# EAGLE design UART_Breakout_ES_PCB (EAGLE 9.6.2)
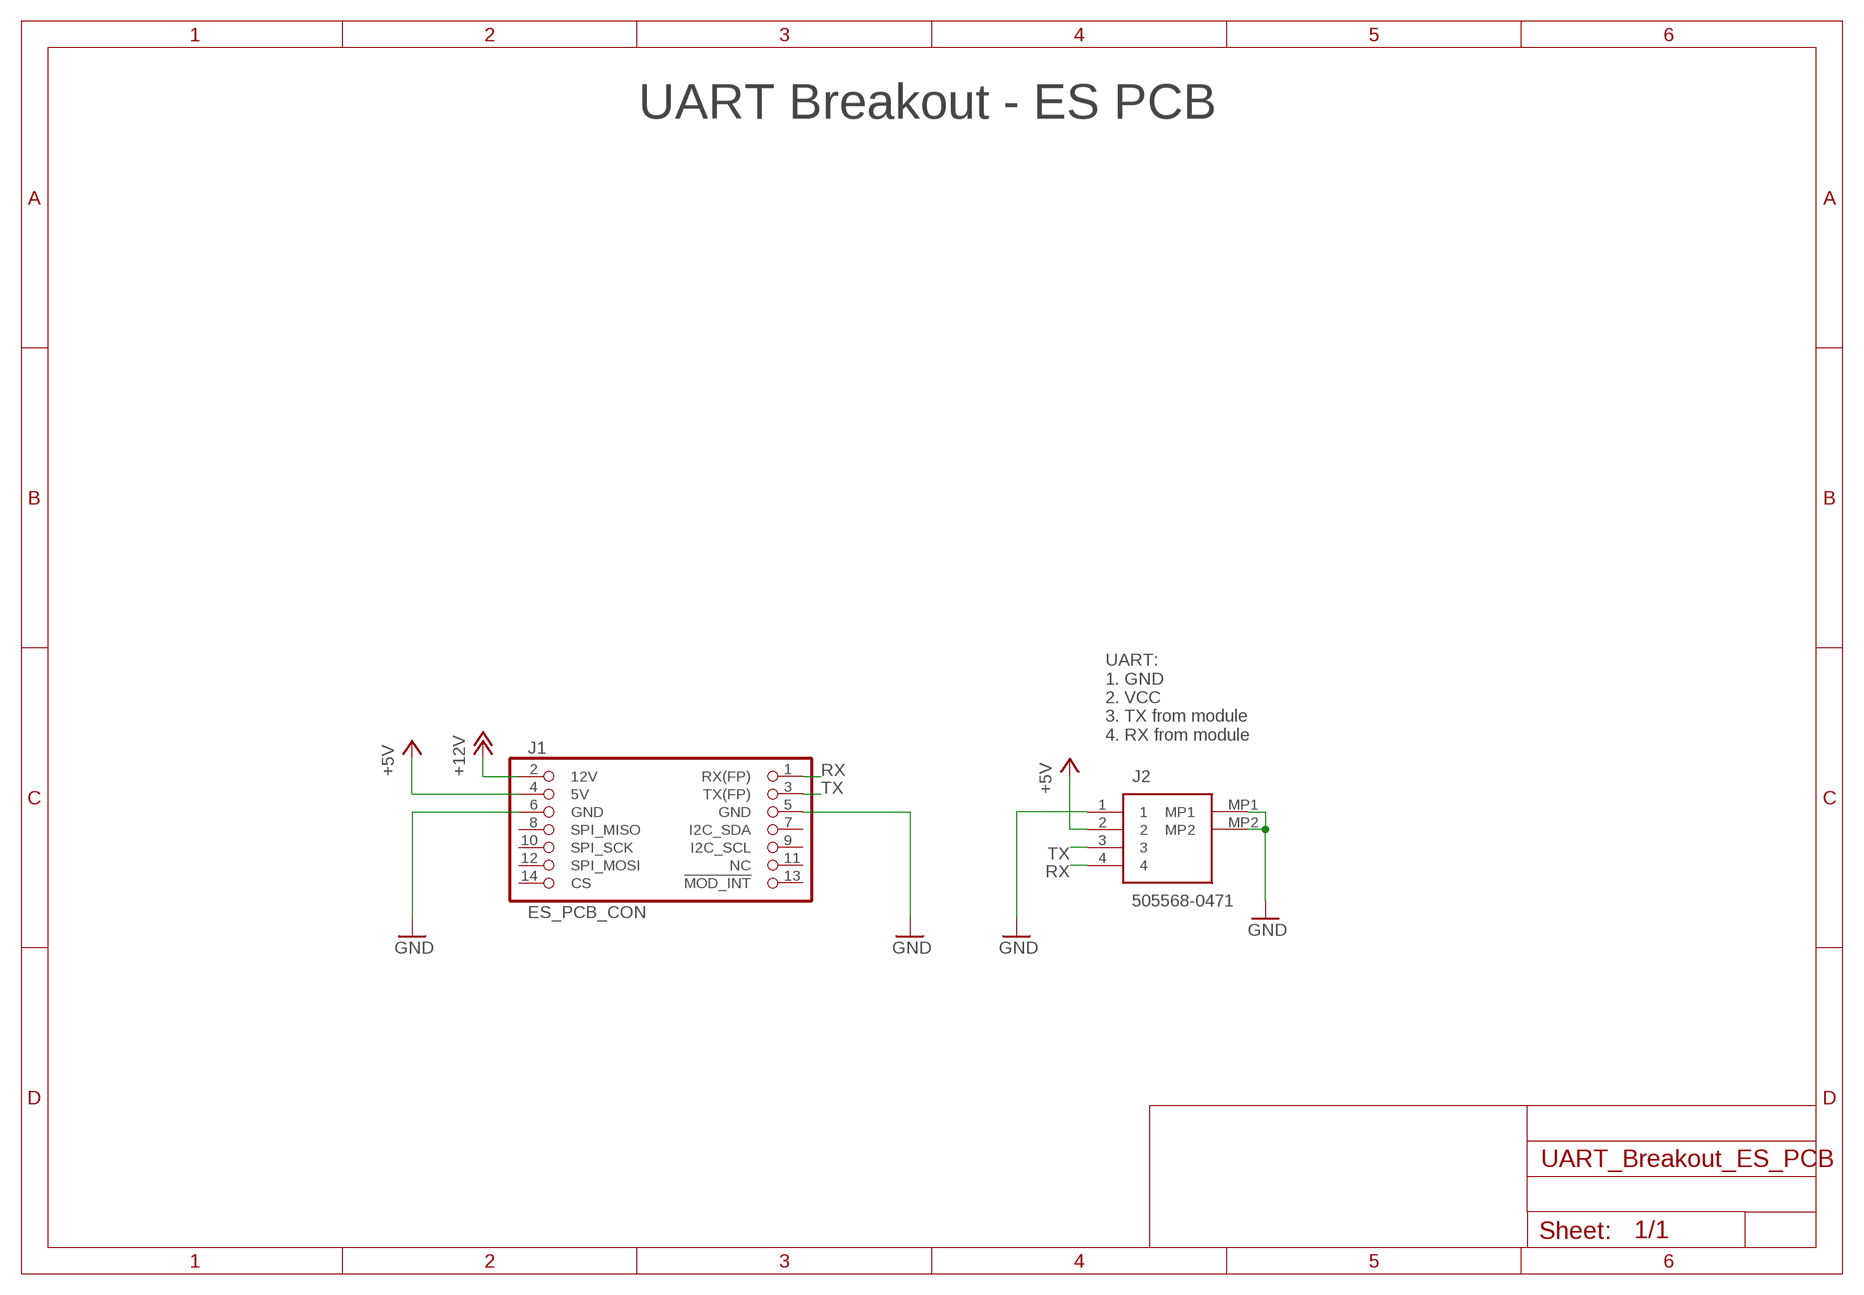
[diagram p0: schematic, sheet 1]

## Parts
J1  ES_PCB_CON  [ES_PCB_CON]
J2  505568-0471  [5055680471]

## Nets
+5V: J1.4(5V) J2.2
+12V: J1.2(12V)
GND: J1.6(GND) J2.1 J2.MP1 J2.MP2
N$1: J1.5(GND) ; supply symbol labelled GND
RX: J1.1(RX(FP)) J2.4
TX: J1.3(TX(FP)) J2.3
Unconnected: J1.7(I2C_SDA) J1.8(SPI_MISO) J1.9(I2C_SCL) J1.10(SPI_SCK) J1.11(NC) J1.12(SPI_MOSI) J1.13(!MOD_INT) J1.14(CS)

## Notes on the sheet
- UART Breakout - ES PCB
- UART:
  1. GND
  2. VCC
  3. TX from module
  4. RX from module

## Library data of the parts
J1 = Unicorn_ACU_LIB:ES_PCB_CON
J2 = Unicorn_ACU_LIB:505568-0471: Horizontal

## Net classes
0 default: width 0.3 mm

## Board
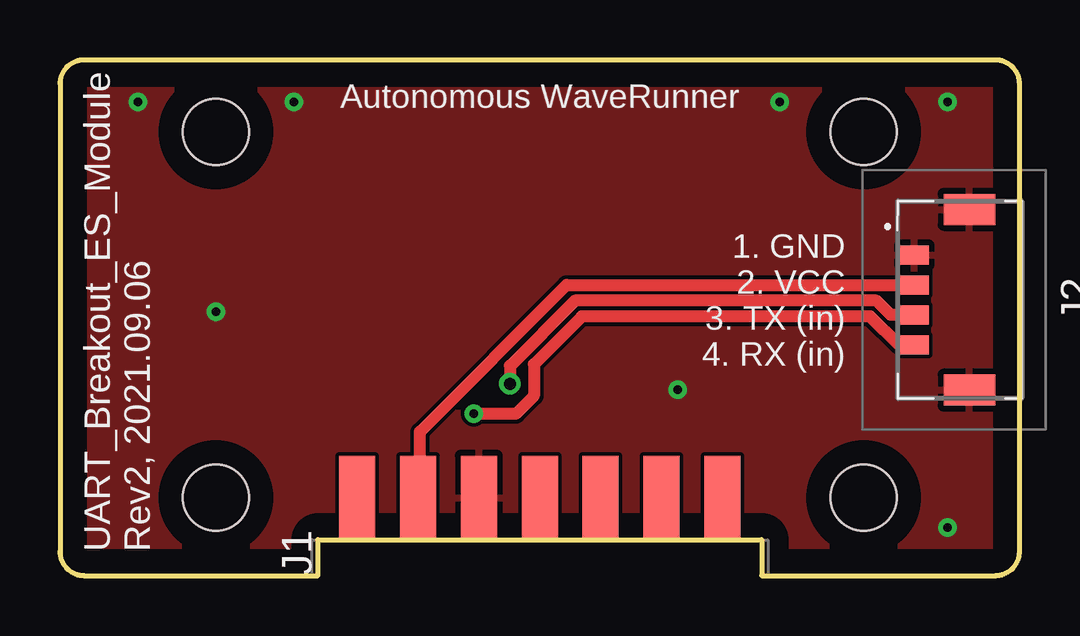
[diagram p1: board, top side]
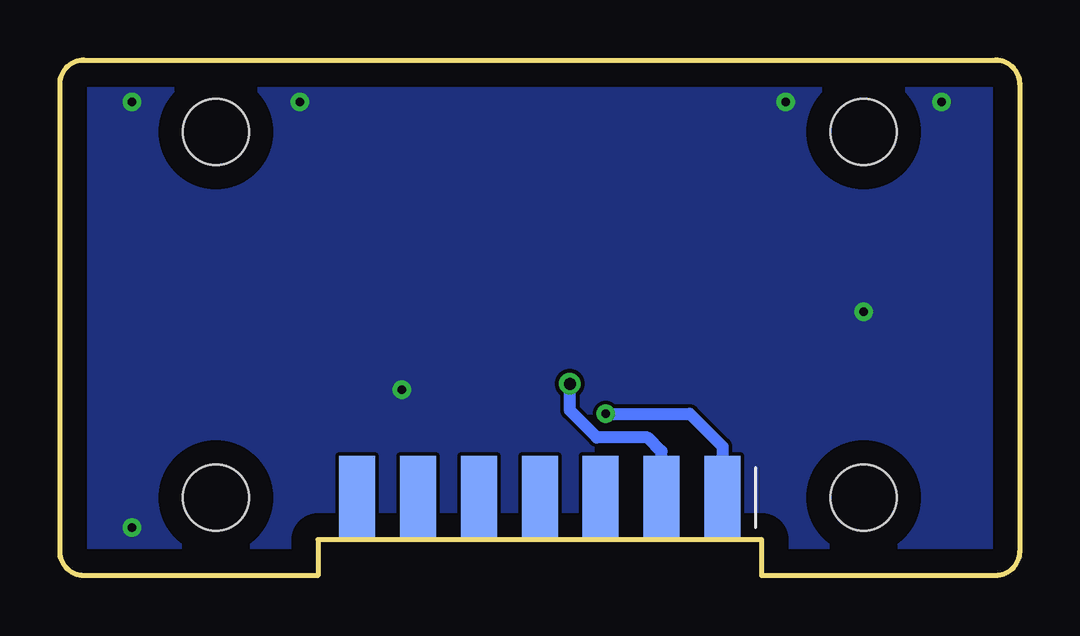
[diagram p2: board, bottom side, seen from below]

Size 40 x 21.5 mm. Coordinates in mm from the lower left corner, seen from the top.
Outline: 39,0 arc90 40,1 40,20.5 arc90 39,21.5 1,21.5 arc90 0,20.5 0,1 arc90 1,0 10.75,0 10.75,1.5 29.25,1.5 29.25,0 39,0
Copper layers (1*16): Top 0.035mm / dielectric 1.5mm / Bottom 0.035mm
Design rules "default": minimum track width 6mil, minimum drill 0.35mm, track to track 6mil, track to pad 6mil, pad to pad 6mil, via to via 6mil, smd to smd 6mil, copper to edge 40mil, drill to drill 6mil, minimum pad ring 10mil, minimum via ring 8mil, stop-mask expansion 4mil, vias tented up to drill 0mil, thermal gap 10mil
Holes 2.75 mm at 6.5,18.5 6.5,3.25 33.5,3.25 33.5,18.5

### Footprints (pad centres in the part's own frame; a part is rotated, then mirrored left to right if it is on the bottom)
ES_PCB_CON = smd 1.5 x 3.5 bottom: 1 -7.62,1.75; 3 -5.08,1.75; 5 -2.54,1.75; 7 0,1.75; 9 2.54,1.75; 11 5.08,1.75; 13 7.62,1.75 | smd 1.5 x 3.5: 2 -7.62,1.75; 4 -5.08,1.75; 6 -2.54,1.75; 8 0,1.75; 10 2.54,1.75; 12 5.08,1.75; 14 7.62,1.75
5055680471 = smd 0.8 x 1.2: 1 -1.865,-1.882; 2 -0.615,-1.882; 3 0.635,-1.882; 4 1.885,-1.882 | smd 1.3 x 2.15: MP1 -3.765,0.412; MP2 3.765,0.412

### Placement (x,y rotation side)
J1  20,1.5 0 top
J2  37.5,11.5 270 top

### Tracks (layer width: path | path; a pad name or v marks a point on that pad's centre or on a via)
+5V
  Top 0.5: J1.4 15,3.33 15,6 21.11,12.12 J2.2
GND  (via drill 0.35)
  other vias: 3.25,19.75 9.75,19.75 6.5,11 25.75,7.75 30,19.75 37,19.75 37,2
  pour Top: 0,21.5 0,0 40,0 40,21.5
  pour Bottom: 0,21.5 0,0 40,0 40,21.5
RX  (via drill 0.35)
  Top 0.5: J2.4 34.96,9.62 33.77,10.81 21.75,10.81 19.75,8.81 19.75,7.5 19,6.75 v17.25,6.75
  Bottom 0.5: v17.25,6.75 13.75,6.75 12.38,5.38 J1.1
TX  (via drill 0.5)
  Top 0.5: J2.3 34.63,10.87 34.04,11.46 21.46,11.46 18.75,8.75 v18.75,8
  Bottom 0.5: J1.3 14.92,5.18 15.5,5.75 17.61,5.75 18.75,6.89 v18.75,8

### Text on the board
tPlace: Autonomous WaveRunner | 1. GND / 2. VCC / 3. TX (in) / 4. RX (in) | UART_Breakout_ES_Module / Rev2, 2021.09.06